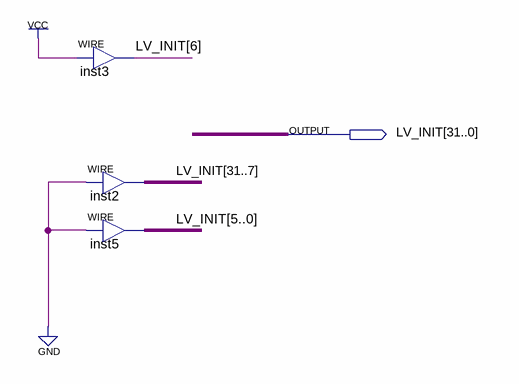
[diagram p0: schematic sheet]
// Quartus schematic LV_initial_address.bdf as structural Verilog: 3 symbols, 1 pins
module LV_initial_address (
  output [31:0] LV_INIT
);

  assign LV_INIT[6] = 1'b1;  // WIRE inst3
  assign LV_INIT[31:7] = {25{1'b0}};  // WIRE inst2
  assign LV_INIT[5:0] = {6{1'b0}};  // WIRE inst5
endmodule
